# EAGLE schematic System Schematic (EAGLE 9.6.2)
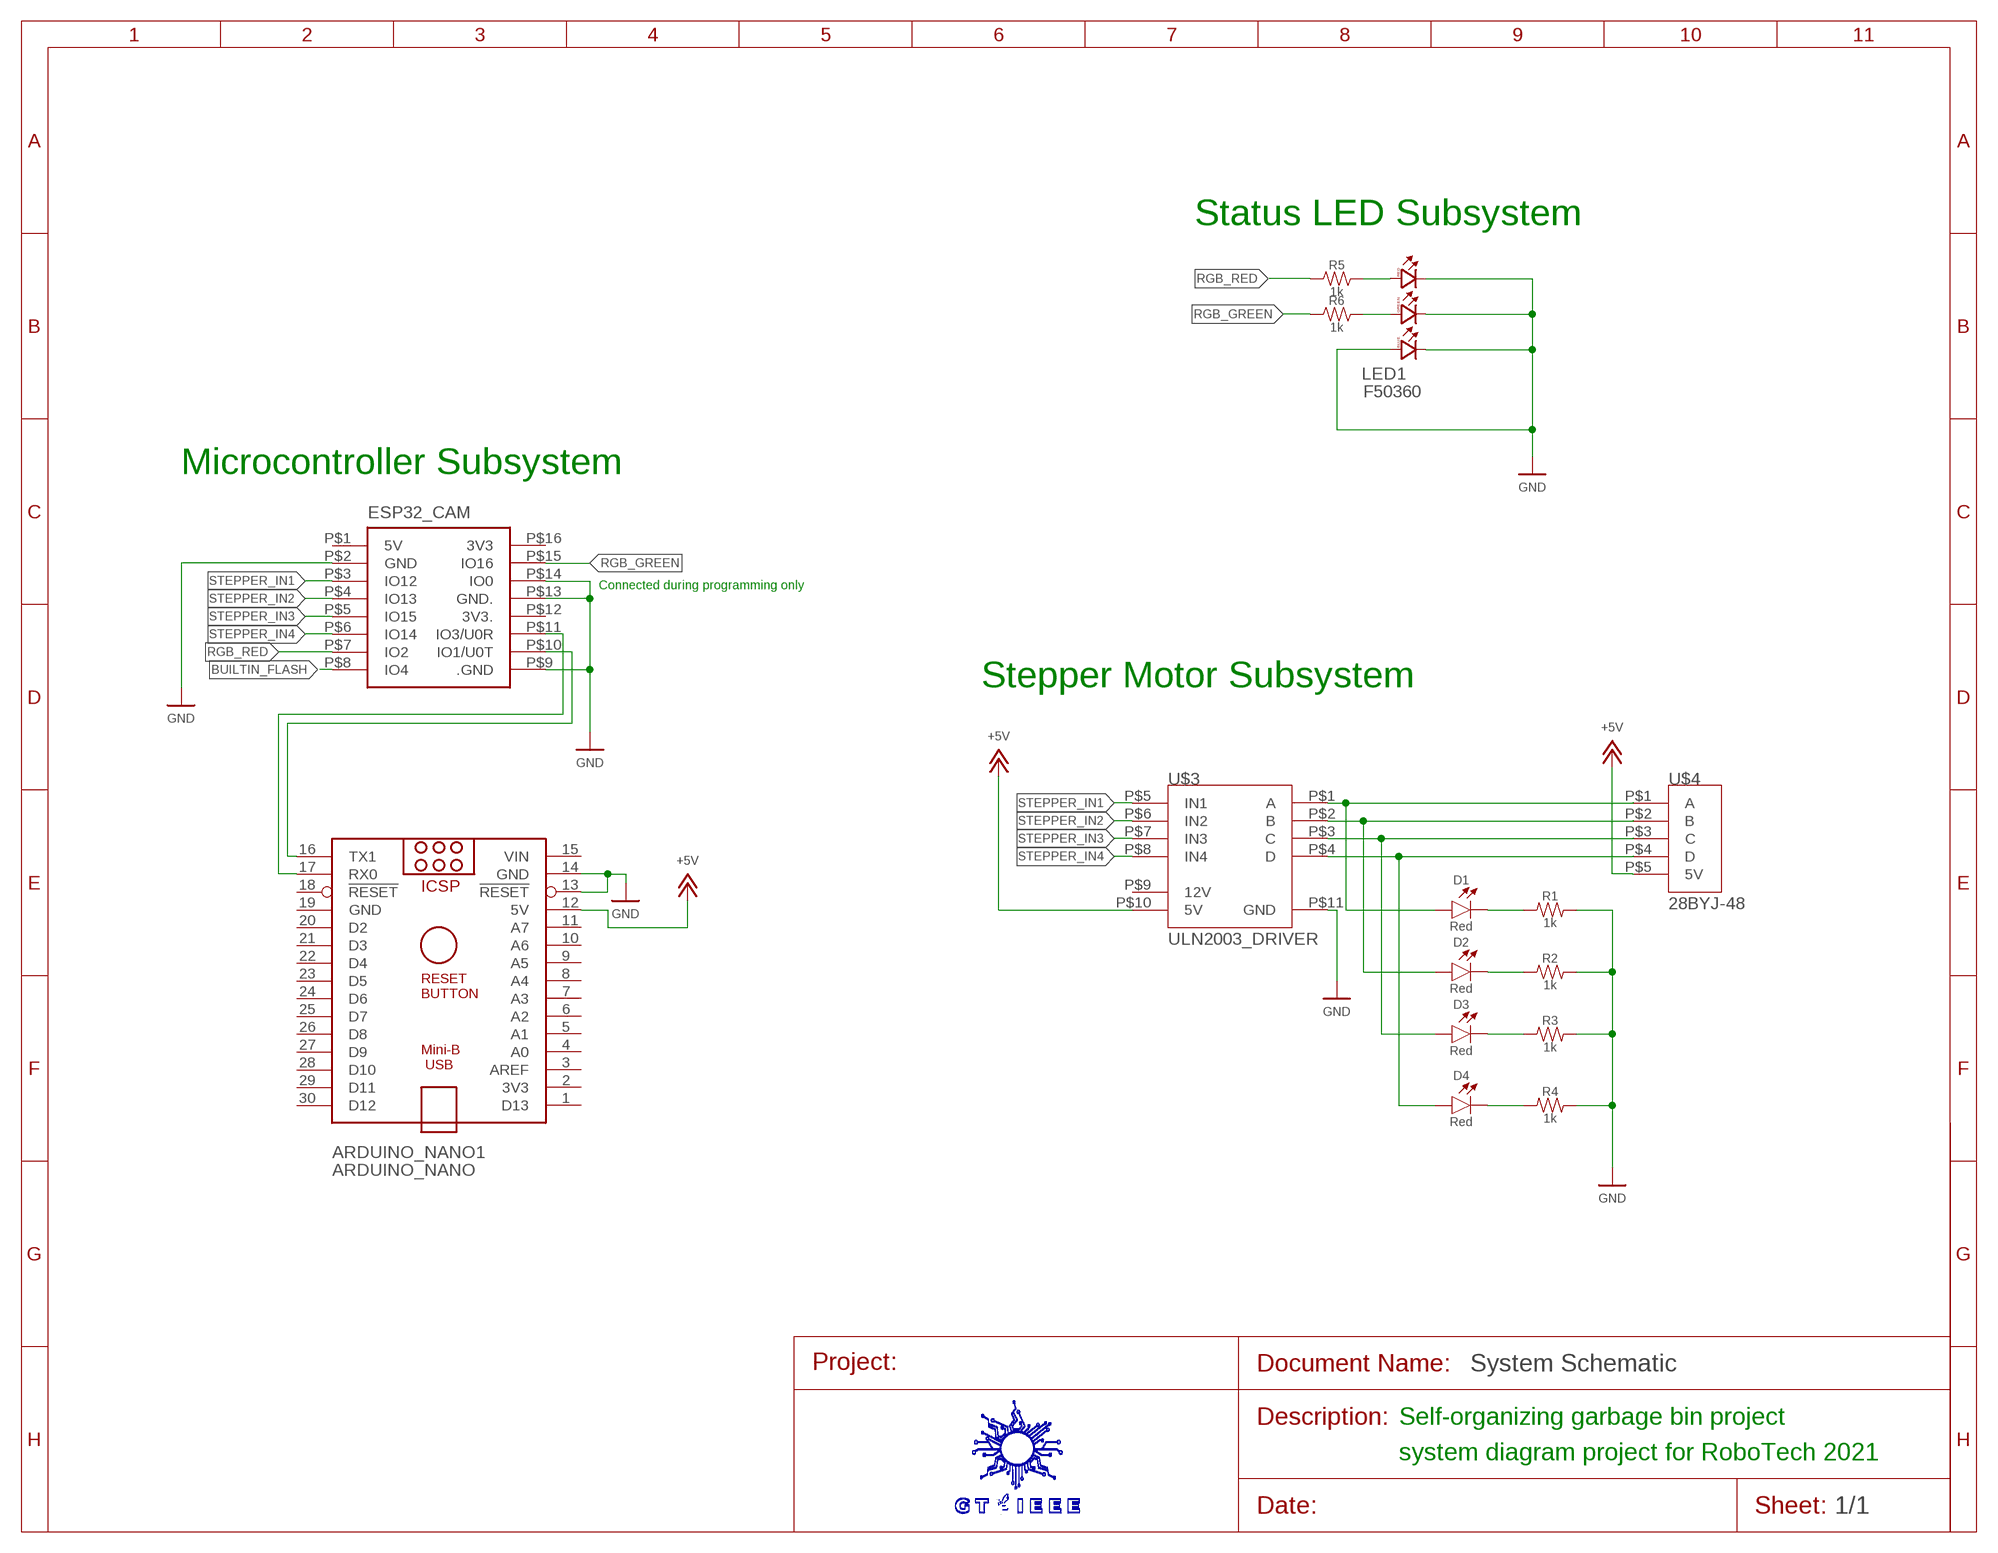
[diagram p0: schematic, sheet 1]

## Parts
ARDUINO_NANO1  ARDUINO_NANO  [ARDUINO_NANO]
D1  LED_0603_RED  [0603-LED]
D2  LED_0603_RED  [0603-LED]
D3  LED_0603_RED  [0603-LED]
D4  LED_0603_RED  [0603-LED]
ESP32_CAM  ESP32-CAM  [ESP32-CAM]
LED1  F50360  [F50360]
R1  RESISTOR_0603_1K  [0603-RES]
R2  RESISTOR_0603_1K  [0603-RES]
R3  RESISTOR_0603_1K  [0603-RES]
R4  RESISTOR_0603_1K  [0603-RES]
R5  RESISTOR_0603_1K  [0603-RES]
R6  RESISTOR_0603_1K  [0603-RES]
U$3  ULN2003_DRIVER  [MOCK_ULN2003_DRIVER]
U$4  28BYJ-48  [MOCK_28BYJ-48]

## Nets
+5V: ARDUINO_NANO1.12(5V) U$4.P$5(5V)
BUILTIN_FLASH: ESP32_CAM.P$8(IO4)
GND: ARDUINO_NANO1.13(!RESET) ARDUINO_NANO1.14(GND) ESP32_CAM.P$2(GND) ESP32_CAM.P$9(.GND) ESP32_CAM.P$13(GND.) ESP32_CAM.P$14(IO0) LED1.BA LED1.BC LED1.GC LED1.RC R1.2 R2.2 R3.2 R4.2
N$1: D1.2(A) U$3.P$1(A) U$4.P$1(A)
N$2: ARDUINO_NANO1.16(TX1) ESP32_CAM.P$10(IO1/U0T)
N$3: D2.2(A) U$3.P$2(B) U$4.P$2(B)
N$4: ARDUINO_NANO1.17(RX0) ESP32_CAM.P$11(IO3/U0R)
N$5: D3.2(A) U$3.P$3(C) U$4.P$3(C)
N$6: D4.2(A) U$3.P$4(D) U$4.P$4(D)
N$7: U$3.P$10(5V) ; supply symbol labelled +5V
N$8: D1.1(C) R1.1
N$9: D2.1(C) R2.1
N$10: D3.1(C) R3.1
N$11: D4.1(C) R4.1
N$12: U$3.P$11(GND) ; supply symbol labelled GND
N$16: LED1.RA R5.2
N$17: LED1.GA R6.2
RGB_GREEN: ESP32_CAM.P$15(IO16) R6.1
RGB_RED: ESP32_CAM.P$7(IO2) R5.1
STEPPER_IN1: ESP32_CAM.P$3(IO12) U$3.P$5(IN1)
STEPPER_IN2: ESP32_CAM.P$4(IO13) U$3.P$6(IN2)
STEPPER_IN3: ESP32_CAM.P$5(IO15) U$3.P$7(IN3)
STEPPER_IN4: ESP32_CAM.P$6(IO14) U$3.P$8(IN4)
Unconnected: ARDUINO_NANO1.1(D13) ARDUINO_NANO1.2(3V3) ARDUINO_NANO1.3(AREF) ARDUINO_NANO1.4(A0) ARDUINO_NANO1.5(A1) ARDUINO_NANO1.6(A2) ARDUINO_NANO1.7(A3) ARDUINO_NANO1.8(A4) ARDUINO_NANO1.9(A5) ARDUINO_NANO1.10(A6) ARDUINO_NANO1.11(A7) ARDUINO_NANO1.18(!RESET) ARDUINO_NANO1.20(D2) ARDUINO_NANO1.21(D3) ARDUINO_NANO1.22(D4) ARDUINO_NANO1.23(D5) ARDUINO_NANO1.24(D6) ARDUINO_NANO1.25(D7) ARDUINO_NANO1.26(D8) ARDUINO_NANO1.27(D9) ARDUINO_NANO1.28(D10) ARDUINO_NANO1.29(D11) ARDUINO_NANO1.30(D12) ESP32_CAM.P$1(5V) ESP32_CAM.P$12(3V3.) ESP32_CAM.P$16(3V3)

## Notes on the sheet
- Status LED Subsystem
- Microcontroller Subsystem
- Connected during programming only
- Stepper Motor Subsystem
- Self-organizing garbage bin project
- system diagram project for RoboTech 2021

## Power pins joined to a net without a drawn wire
12V: U$3.P$9(12V)
GND: ARDUINO_NANO1.19(GND)
VIN: ARDUINO_NANO1.15(VIN)

## Library data of the parts
ARDUINO_NANO1 = roboGech_devices:ARDUINO_NANO: Arduino Nano V3.0 Overview: The Arduino Nano is a small, complete, and breadboard-friendly board based on the ATmega328 (Arduino Nano 3.x) or ATmega168 (Arduino Nano 2.x). It has more or less the same functionality of the Arduino Duemilanove, but in a different package. It lacks only a DC power jack, and works with a Mini-B USB cable instead of a standard one. The Nano was designed and is being produced by Gravitech. Specifications: Microcontroller Atmel ATmega168 or ATmega328 Operating Voltage (logic level) 5 V Input Voltage (recommended) 7-12 V Input Voltage (limits) 6-20 V Digital I/O Pins 14 (of which 6 provide PWM output) Analog Input Pins 8 DC Current per I/O Pin 40 mA Flash Memory 16 KB (ATmega168) or 32 KB (ATmega328) of which 2 KB used by bootloader SRAM 1 KB (ATmega168) or 2 KB (ATmega328) EEPROM 512 bytes (ATmega168) or 1 KB (ATmega328) Clock Speed 16 MHz Dimensions 0.73" x 1.70" Length 45 mm Width 18 mm Weigth 5 g Power: The Arduino Nano can be powered via the Mini-B USB connection, 6-20V unregulated external power supply (pin 30), or 5V regulated external power supply (pin 27). The power source is automatically selected to the highest voltage source. Memory: The ATmega168 has 16 KB of flash memory for storing code (of which 2 KB is used for the bootloader); the ATmega328 has 32 KB, (also with 2 KB used for the bootloader). The ATmega168 has 1 KB of SRAM and 512 bytes of EEPROM (which can be read and written with the EEPROM library); the ATmega328 has 2 KB of SRAM and 1 KB of EEPROM. Input and Output: Each of the 14 digital pins on the Nano can be used as an input or output, using pinMode(), digitalWrite(), and digitalRead() functions. They operate at 5 volts. Each pin can provide or receive a maximum of 40 mA and has an internal pull-up resistor (disconnected by default) of 20-50 kOhms. In addition, some pins have specialized functions. Visit Arduino - ArduinoBoardNano <https://www.arduino.cc/en/Main/ArduinoBoardNano> Check availability <https://pricing.snapeda.com/parts/Arduino%20Nano/Arduino/view-part?ref=eda>; AVAILABILITY: Not in stock; DESCRIPTION: Small, complete, and breadboard-friendly board based on the ATmega328 (Arduino Nano 3.x); MF: Arduino; MP: Arduino Nano; PACKAGE: Non-Standard Arduino; PRICE: None
D1-D4 = HyTechDevices:LED_?_*: LED 0603 Blue <https://www.mouser.com/datasheet/2/216/APT1608VBC_D-246010.pdf> Green <https://www.mouser.com/datasheet/2/216/APT1608ZGCK-1173388.pdf> Orange <https://www.mouser.com/datasheet/2/216/APT1608SECK-6197.pdf> Red <https://www.mouser.com/datasheet/2/216/APT1608SECK-J3-PRV-1173336.pdf> White <https://www.mouser.com/datasheet/2/50/SM0603UWC-880813.pdf> Yellow <https://www.mouser.com/datasheet/2/216/APT1608SYCK-J3-PRV-1173311.pdf> 2835 (Series not on Digikey) Lumiled LUXEON 2835 Color Line <https://www.mouser.com/datasheet/2/602/DS236_luxeon_2835_color_line_datasheet-1596094.pdf>; COLOR: Red; DKPN: 754-1786-1-ND; MANUFACTURER: Kingbright; MOPN: 604-APT1608SECKJ3PRV; MPN: APT1608SECK/J3-PRV
ESP32_CAM = roboGech_devices:ESP32-CAM: Check availability <https://pricing.snapeda.com/parts/ESP32-CAM/AI-Thinker/view-part?ref=eda>; AVAILABILITY: Not in stock; DESCRIPTION: ESP32 ESP32 Transceiver; 802.11 a/b/g/n (Wi-Fi, WiFi, WLAN), Bluetooth® Smart 4.x Low Energy (BLE) Evaluation Board; MF: AI-Thinker; MP: ESP32-CAM; PACKAGE: None; PRICE: None
LED1 = roboGech_devices:F50360: Full color Z-Power LED RGB P5-II Series Source: http://www.seoulsemicon.co.kr .. F50360.pdf
R1-R6 = roboGech_devices:RESISTOR_?_*: Resistor PWR163 Series <https://www.mouser.com/datasheet/2/54/pwr163-777985.pdf> AC Series <https://www.mouser.com/datasheet/2/447/Yageo_PYu_AC_51_RoHS_L_7_1714230-1874691.pdf> PU Series <https://www.mouser.com/datasheet/2/447/PYu-PU_51_RoHS_L_6-1504619.pdf> ERA Series <https://www.mouser.com/datasheet/2/315/AOA0000C307-1149632.pdf> PWR263 Series <https://www.mouser.com/datasheet/2/54/pwr263s_35-778069.pdf> RC Series <https://www.mouser.com/datasheet/2/447/Yageo_03_18_2021_PYu_RC_Group_51_RoHS_L_11-2199992.pdf> ERJ PB3, PB6 Series <https://www.mouser.com/datasheet/2/315/AOA0000C328-1530132.pdf> ERJ PA2, P03, PA3, P06, P08, P14 Series <https://www.mouser.com/datasheet/2/315/AOA0000C331-1141874.pdf>; DKPN: 311-1.00KHRCT-ND; MANUFACTURER: Yageo; MOPN: 603-RC0603FR-071KL; MPN: RC0603FR-071KL; POWER: 0.1W; RESISTANCE: 1k; TOLERANCE: 1%; VOLTAGE_CONTINUOUS: 10.00V; VOLTAGE_MAX: 75V
U$3 = roboGech_devices:ULN2003_DRIVER
U$4 = roboGech_devices:28BYJ-48